# EAGLE schematic i2c-hub (EAGLE 6.4)
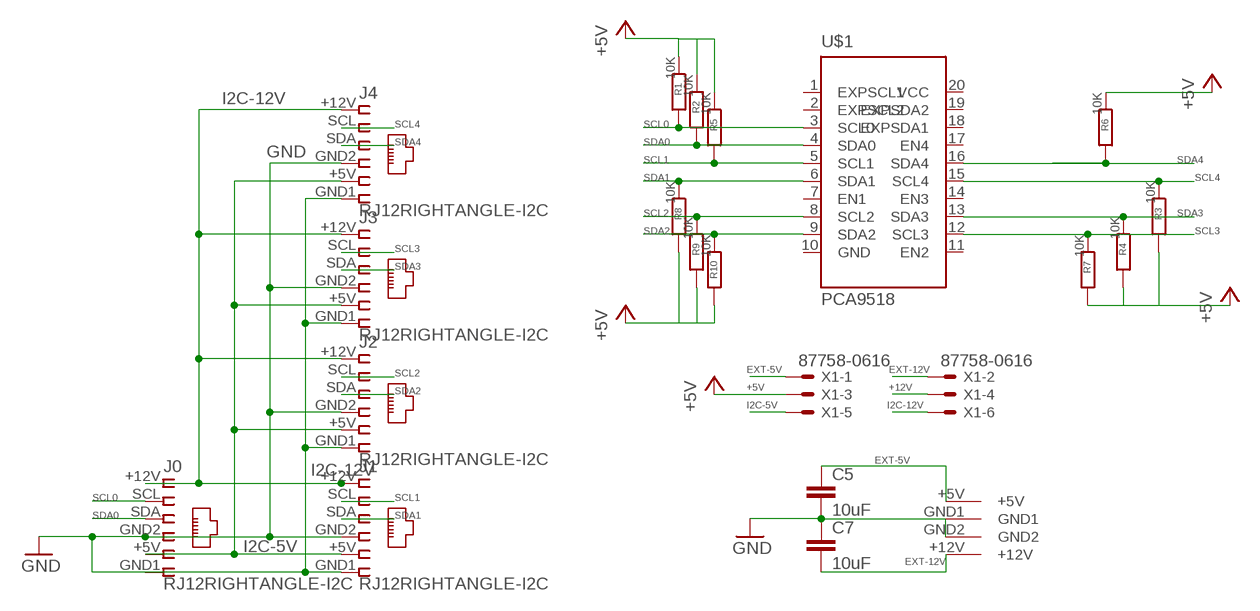
[diagram p0: schematic, sheet 1]

## Parts
C5  10uF  C-EUC1206  [C1206]
C7  10uF  C-EUC1206  [C1206]
J0  RJ12RIGHTANGLE-I2C  [RJ12-RIGHTANGLE-I2C]
J1  RJ12RIGHTANGLE-I2C  [RJ12-RIGHTANGLE-I2C]
J2  RJ12RIGHTANGLE-I2C  [RJ12-RIGHTANGLE-I2C]
J3  RJ12RIGHTANGLE-I2C  [RJ12-RIGHTANGLE-I2C]
J4  RJ12RIGHTANGLE-I2C  [RJ12-RIGHTANGLE-I2C]
R1  10K  R-EU_M1206  [M1206]
R2  10K  R-EU_M1206  [M1206]
R3  10K  R-EU_M1206  [M1206]
R4  10K  R-EU_M1206  [M1206]
R5  10K  R-EU_M1206  [M1206]
R6  10K  R-EU_M1206  [M1206]
R7  10K  R-EU_M1206  [M1206]
R8  10K  R-EU_M1206  [M1206]
R9  10K  R-EU_M1206  [M1206]
R10  10K  R-EU_M1206  [M1206]
U$1  PCA9518  [SO20W]
U$2  KPJX-4S-S  [KPJX-4S-S]
X1  87758-0616  [87758-0616]

## Nets
+5V: R1.1 R2.1 R3.2 R4.2 R5.1 R6.1 R7.2 R9.2 R10.2 X1.3
+12V: X1.4
EXT-5V [highpower]: C5.1 U$2.+5V X1.1
EXT-12V [highpower]: C7.2 U$2.+12V X1.2
GND [power]: C5.2 C7.1 J0.GND1 J0.GND2 J1.GND1 J1.GND2 J2.GND1 J2.GND2 J3.GND1 J3.GND2 J4.GND1 J4.GND2 U$2.GND1 U$2.GND2
I2C-5V [power]: J0.+5V J1.+5V J2.+5V J3.+5V J4.+5V X1.5
I2C-12V: J0.+12V J1.+12V J2.+12V J3.+12V J4.+12V X1.6
N$6: R8.2
SCL0: J0.SCL R1.2 U$1.3(SCL0)
SCL1: J1.SCL R5.2 U$1.5(SCL1)
SCL2: J2.SCL R9.1 U$1.8(SCL2)
SCL3: J3.SCL R7.1 U$1.12(SCL3)
SCL4: J4.SCL R3.1 U$1.15(SCL4)
SDA0: J0.SDA R2.2 U$1.4(SDA0)
SDA1: J1.SDA R8.1 U$1.6(SDA1)
SDA2: J2.SDA R10.1 U$1.9(SDA2)
SDA3: J3.SDA R4.1 U$1.13(SDA3)
SDA4: J4.SDA R6.2 U$1.16(SDA4)
Unconnected: U$1.1(EXPSCL1) U$1.2(EXPSCL2) U$1.7(EN1) U$1.11(EN2) U$1.14(EN3) U$1.17(EN4) U$1.18(EXPSDA1) U$1.19(EXPSDA2)

## Power pins joined to a net without a drawn wire
GND: U$1.10(GND)
VCC: U$1.20(VCC)

## Library data of the parts
C5 C7 = rcl:C-EU: CAPACITOR, European symbol
J0 J1-J4 = lpatiny:RJ12: CORCOM Modular RJ Jacks No Shield Source: www.tycoelectronics.com .. ENG_DS_1654001_1099_RJ_L_0507.pdf
R1-R10 = resistor:R-EU_: RESISTOR, European symbol
U$1 = lpatiny:PCA9518
U$2 = lpatiny:KPJX-4S-S
X1 = con-molex:87758-0616: 6 Pin - 2mm Dual Row Single Wafer, Vertical T/H HDR Source: http://www.molex.com/pdm_docs/sd/877580616_sd.pdf; MPN: 87758-0616; OC_FARNELL: 7472323; OC_NEWARK: 25M5667

## Net classes
0 default: width 0.457 mm
1 power: width 0.457 mm
2 highpower: width 1.372 mm
3 fine: width 0.305 mm